# Altium schematic sheet 06_TOFs.SchDoc: GAP9Shield
size A3; DrawnBy: Hanna Müller and Victor Kartsch; Organization: Integrated Systems Laboratory; DocumentNumber: 6; Revision: v1.0; SheetNumber: 6; SheetTotal: 9
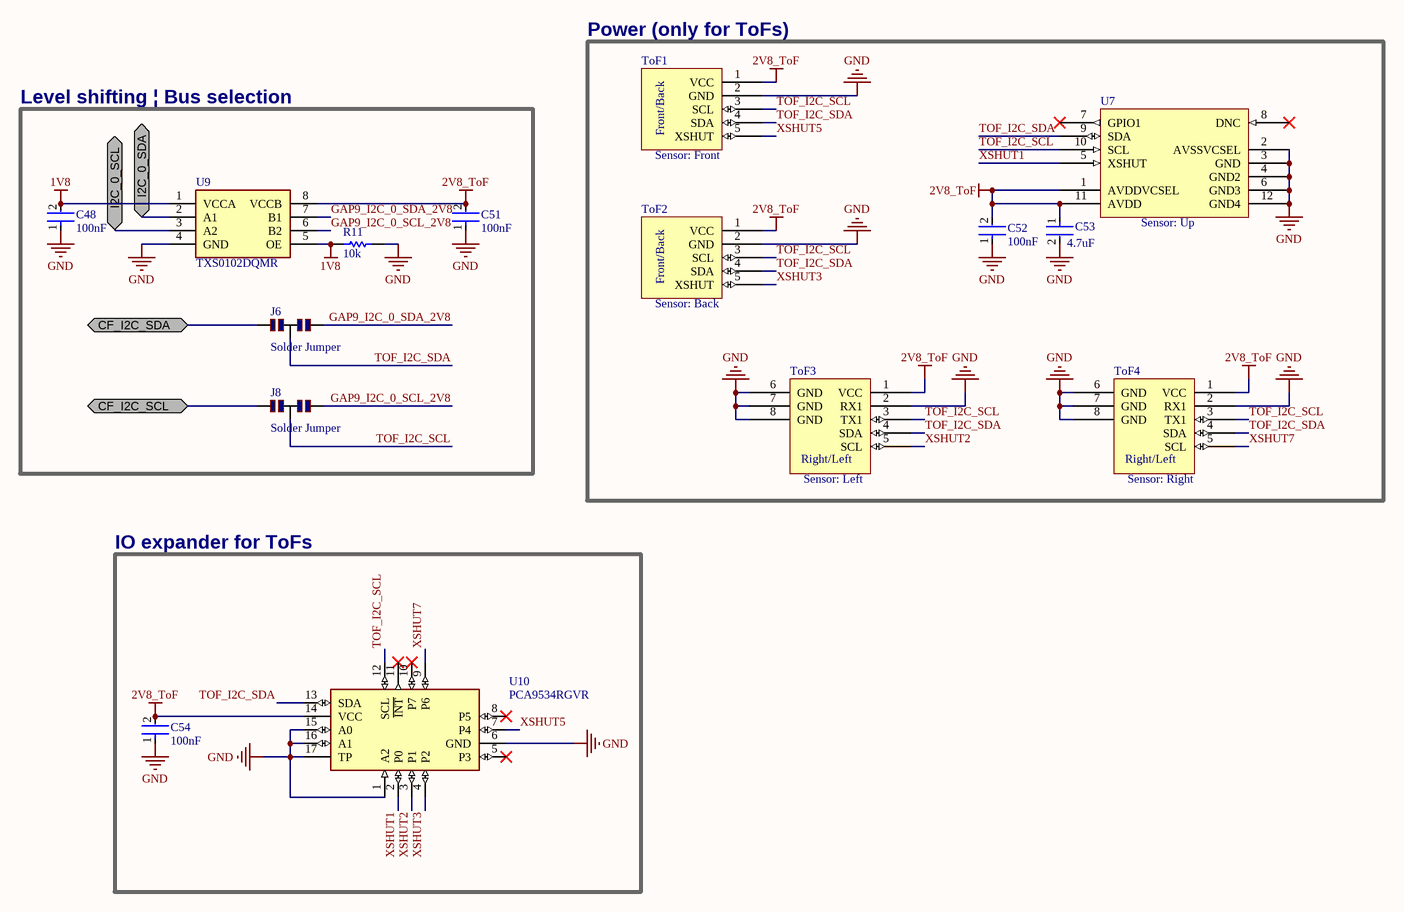
[diagram p0: 06_TOFs.SchDoc]

## Parts
C48  value 100nF  [FP-C1005-050-0_05-MFG]  (hidden comment: C1005X5R1E104K050BC)
C51  value 100nF  [FP-C1005-050-0_05-MFG]  (hidden comment: C1005X5R1E104K050BC)
C52  value 100nF  [FP-C1005-050-0_05-MFG]  (hidden comment: C1005X5R1E104K050BC)
C53  value 4.7uF  [FP-C1005-050-0_15-MFG]  (hidden comment: C1005X5R0J475K050BC)
C54  value 100nF  [FP-C1005-050-0_05-MFG]  (hidden comment: C1005X5R1E104K050BC)
J6  Solder Jumper  [Jumper 3 pins]  (no BOM)
J8  Solder Jumper  [Jumper 3 pins]  (no BOM)
R11  value 10k  [RESC0603X28X15LL05T05]  (hidden comment: CRCW020110K0FNED)
ToF1  (no value)  [ToF_Front_Back]
ToF2  (no value)  [ToF_Front_Back]
ToF3  (no value)  [ToF_Right_Left]
ToF4  (no value)  [ToF_Right_Left]
U7  VL53L1CXV0FY/1  [TOF]  (value not drawn)
U9  TXS0102DQMR  [SON40P120X180X40-8N]
U10  PCA9534RGVR  [QFN65P400X400X100-17N-D]

## Blocks framed on the sheet
Power (only for ToFs): C52 C53 ToF1-ToF4 U7
Level shifting | Bus selection: C48 C51 J6 J8 R11 U9
IO expander for ToFs: C54 U10

## Ports
CF_I2C_SCL (bidir), CF_I2C_SDA (bidir), I2C_0_SCL (bidir), I2C_0_SDA (bidir)

## Nets
1V8: C48.2 R11.2 U9.1(VCCA) U9.5(OE)
2V8_ToF: C51.2 C52.2 C53.1 C54.2 ToF1.1(VCC) ToF2.1(VCC) ToF3.1(VCC) ToF4.1(VCC) U7.1(AVDDVCSEL) U7.11(AVDD) U9.8(VCCB) U10.14(VCC)
GND: C48.1 C51.1 C52.1 C53.2 C54.1 R11.1 ToF1.2(GND) ToF2.2(GND) ToF3.2(RX1) ToF3.6(GND) ToF3.7(GND) ToF3.8(GND) ToF4.2(RX1) ToF4.6(GND) ToF4.7(GND) ToF4.8(GND) U7.2(AVSSVCSEL) U7.3(GND) U7.4(GND2) U7.6(GND3) U7.12(GND4) U9.4(GND) U10.1(A2) U10.6(GND) U10.15(A0) U10.16(A1) U10.17(TP)
CF_I2C_SCL: J8.1 ; port CF_I2C_SCL
CF_I2C_SDA: J6.1 ; port CF_I2C_SDA
GAP9_I2C_0_SCL_2V8: J8.3 U9.6(B2)
GAP9_I2C_0_SDA_2V8: J6.3 U9.7(B1)
I2C_0_SCL: U9.3(A2) ; port I2C_0_SCL
I2C_0_SDA: U9.2(A1) ; port I2C_0_SDA
TOF_I2C_SCL: J8.2 ToF1.3(SCL) ToF2.3(SCL) ToF3.3(TX1) ToF4.3(TX1) U7.10(SCL) U10.12(SCL)
TOF_I2C_SDA: J6.2 ToF1.4(SDA) ToF2.4(SDA) ToF3.4(SDA) ToF4.4(SDA) U7.9(SDA) U10.13(SDA)
XSHUT1: U7.5(XSHUT) U10.2(P0)
XSHUT2: ToF3.5(SCL) U10.3(P1)
XSHUT3: ToF2.5(XSHUT) U10.4(P2)
XSHUT5: ToF1.5(XSHUT) U10.7(P4)
XSHUT7: ToF4.5(SCL) U10.9(P6)

Not connected (* = marked no-connect by the designer): U7 7(GPIO1)* 8(DNC)*; U10 5(P3)* 8(P5)* 10(P7)* 11(~{INT})*

## Notes on the sheet
- (near ToF1) Sensor: Front
- (near U7) Sensor: Up
- (near ToF2) Sensor: Back
- (near ToF3) Sensor: Left
- (near ToF4) Sensor: Right
- 1
- 2
- 3
- 4
- 5
- 6
- 7
- 8
- A
- B
- C
- D
- Project:
- Date:
- Drawing number:
- Rev:
- Format:
- A3
- Drawn by:
- Laboratory:
- Page
- Sheet:
- of
- File:
- (in symbol ToF_Front_Back) Front/Back
- (in symbol ToF_Right_Letf) Right/Left

## Library data of the parts
C48 C51 C52 C54 = CMP-2000-06000-2: Multilayer Ceramic Capacitors 100nF ±10% 25V X5R SMD 0402; Case Code (Imperial): 0402; Termination: Wraparound; Series: C; Depth: 0.5mm; Voltage Rating (DC): 25V; Contact Plating: Tin; Case Code (Metric): 1005; Dielectric: X5R; Case/Package: 0402; Voltage Rating: 25V; Packaging: Tape and Reel; Thickness: 0.022inch; Dielectric Material: Ceramic; Height: 0.5mm; Weight: 2.3E-05oz; RoHS Compliant: Yes; Width: 0.02inch; Capacitance: 100nF; Tolerance: 10%; Mount: Surface Mount; Package Quantity: 1; Max Operating Temperature: 85°C; Construction: Flat; Min Operating Temperature: -55°C; REACH SVHC: No SVHC; Resistor Type: Ceramic; Length: 1mm; Lead Free: Lead Free; Voltage: 25V
C53 = CMP-2000-05437-2: CAP CER 4.7UF 6.3V X5R 0402; Tolerance: 10%; Dielectric Material: Ceramic; Voltage: 6.3V; Capacitance: 4.7uF; Depth: 0.5mm; Height: 0.5mm; Length: 1mm; Termination: SMD/SMT; RoHS Compliant: Yes; Series: C; Case/Package: 0402; Dielectric: X5R; Lead Free: Lead Free; Mount: Surface Mount; Max Operating Temperature: 85°C; Min Operating Temperature: -55°C
J6 J8 = CMP-00467-5: Solder Jumper 3 Pads; Technology: SMT
R11 = CMP-2004-00016-1: Manufacturer: Vishay Dale; Part Number: CRCW020110K0FNED
ToF1 ToF2 = ToF_Front_Back: ToF PCBs (DNM); Supplier 1: Digi-Key; Supplier Part Number 1: 110990442-ND
ToF3 ToF4 = ToF_Right_Letf: Supplier 1: Digi-Key; Supplier Part Number 1: 110990442-ND
U7 = VL53L1X: Manufacturer: STMicroelectronics; Supplier 1: Digi-Key; Manufacturer Part Number: VL53L1CXV0FY/1; Stock 1: 5939; Pricing 1: 1 = 7.07000, 10 = 6.38600, 100 = 5.28660, 500 = 4.60350, 1000 = 4.00950 (USD); RoHS: No; ComponentLink1URL: http://www.farnell.com/datasheets/2600105.pdf?src-supplier=Farnell; ComponentLink1Description: http://www.farnell.com/datasheets/2600105.pdf?src-supplier=Farnell; ComponentLink2URL: http://www.st.com/content/ccc/resource/technical/document/datasheet/group3/7d/85/c8/95/fb/3b/4e/2d/DM00452094/files/DM00452094.pdf/jcr:content/translations/en.DM00452094.pdf?src-supplier=Digi-Key; ComponentLink2Description: http://www.st.com/content/ccc/resource/technical/document/datasheet/group3/7d/85/c8/95/fb/3b/4e/2d/DM00452094/files/DM00452094.pdf/jcr:content/translations/en.DM00452094.pdf?src-supplier=Digi-Key; Supplier Part Number 1: 497-17764-6-ND
U9 = TXS0102DQMR: Integrated Circuit; Manufacturer_Name: Texas Instruments; Datasheet Link: http://www.ti.com/lit/gpn/txs0102; Height: 0.4mm; Manufacturer_Part_Number: TXS0102DQMR; Mouser Part Number: 595-TXS0102DQMR; Mouser Price/Stock: https://www.mouser.co.uk/ProductDetail/Texas-Instruments/TXS0102DQMR?qs=l3GMcByk76LwJNFmr1RbWA%3D%3D; Arrow Part Number: TXS0102DQMR; Arrow Price/Stock: https://www.arrow.com/en/products/txs0102dqmr/texas-instruments?region=nac
U10 = PCA9534RGVR: Undefined or Miscellaneous; Manufacturer_Name: Texas Instruments; Datasheet Link: http://www.ti.com/lit/gpn/pca9534; Height: 1mm; Manufacturer_Part_Number: PCA9534RGVR; Mouser Part Number: 595-PCA9534RGVR; Mouser Price/Stock: https://www.mouser.co.uk/ProductDetail/Texas-Instruments/PCA9534RGVR?qs=iSMark9AYDX8ZzbjwCykBw%3D%3D; Arrow Part Number: PCA9534RGVR; Arrow Price/Stock: https://www.arrow.com/en/products/pca9534rgvr/texas-instruments